# EAGLE schematic satellite (EAGLE 6.4)
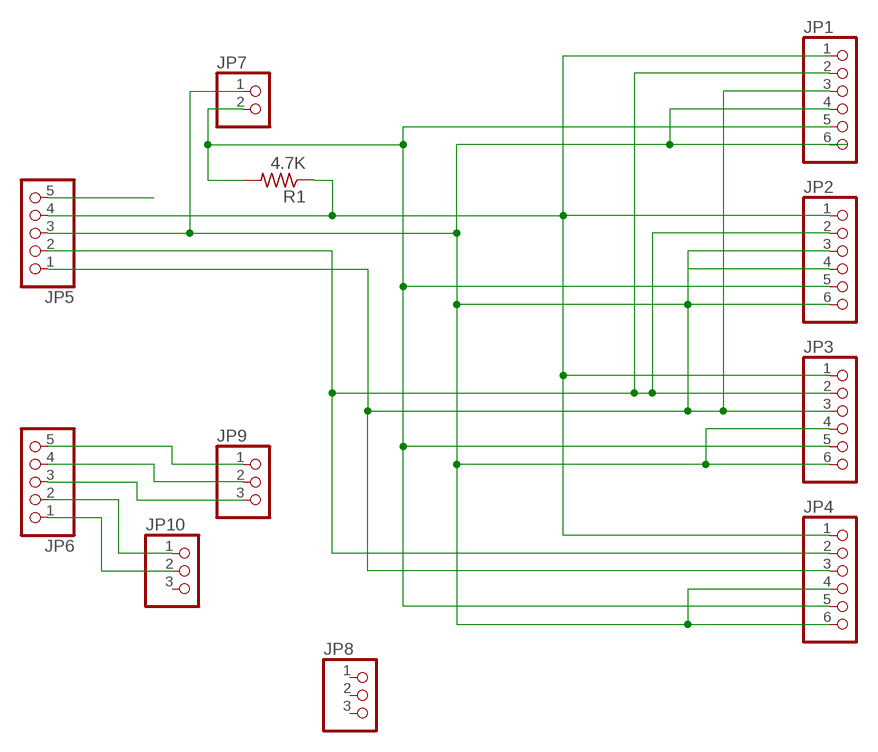
[diagram p0: schematic, sheet 1]

## Parts
JP1  PINHD-1X6  [1X06]
JP2  PINHD-1X6  [1X06]
JP3  PINHD-1X6  [1X06]
JP4  PINHD-1X6  [1X06]
JP5  PINHD-1X5  [1X05]
JP6  PINHD-1X5  [1X05]
JP7  PINHD-1X2  [1X02]
JP8  PINHD-1X3  [1X03]
JP9  PINHD-1X3  [1X03]
JP10  PINHD-1X3  [1X03]
R1  4.7K  R-US_0204/5  [0204/5]
U$1  TECONN5558065-1  [RJ50]

## Nets
5V: JP1.1 JP2.1 JP3.1 JP4.1 JP5.4 R1.1
33V: JP5.5
BR: JP1.5 JP2.5 JP3.5 JP4.5 JP7.2 R1.2
GND: JP1.4 JP2.4 JP2.6 JP3.4 JP3.6 JP4.4 JP4.6 JP5.3 JP7.1
MISO: JP6.5 JP9.1
MOSI: JP6.4 JP9.2
RX: JP1.2 JP2.2 JP3.2 JP4.2 JP5.2
SCK: JP6.3 JP9.3
SCL: JP6.2 JP10.1
SDA: JP6.1 JP10.2
TX: JP1.3 JP2.3 JP3.3 JP4.3 JP5.1
Unconnected: JP1.6 JP8.1 JP8.2 JP8.3 JP10.3

## Library data of the parts
JP1-JP4 = pinhead:PINHD-1X6: PIN HEADER
JP5 JP6 = te-con-rj50:PINHD-1X5: PIN HEADER
JP7 = pinhead:PINHD-1X2: PIN HEADER
JP8-JP10 = pinhead:PINHD-1X3: PIN HEADER
R1 = rcl:R-US_: RESISTOR, American symbol
U$1 = te-con-rj50:TECONN5558065-1